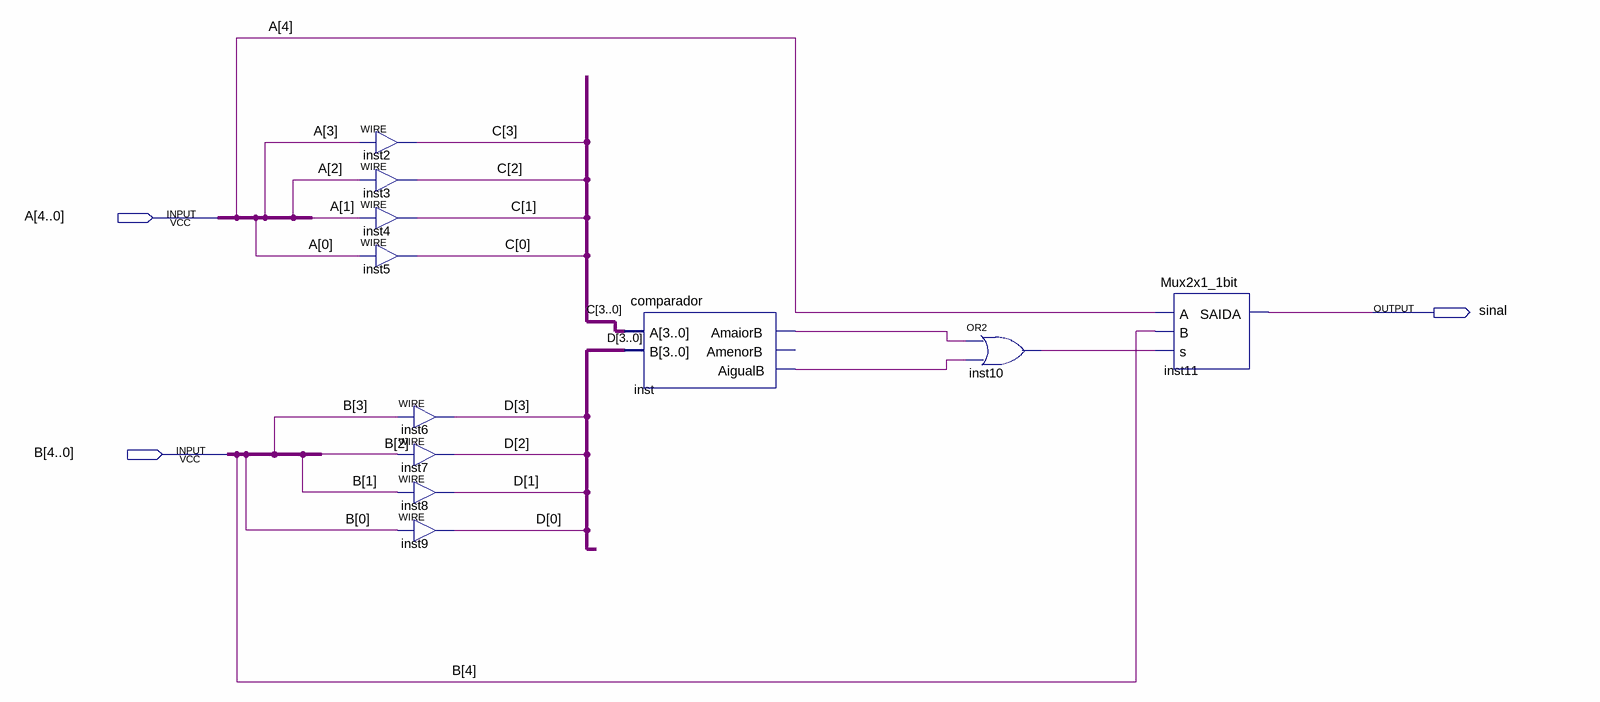
[diagram p0: schematic sheet]
// Quartus schematic sinal.bdf as structural Verilog: 11 symbols, 3 pins
module sinal (
  input  [4:0] A,
  input  [4:0] B,
  output sinal
);

  wire inst10_out, inst_aigualb, inst_amaiorb;
  wire [3:0] C, D;

  assign C[3] = A[3];  // WIRE inst2
  assign C[2] = A[2];  // WIRE inst3
  assign C[1] = A[1];  // WIRE inst4
  assign C[0] = A[0];  // WIRE inst5
  assign D[3] = B[3];  // WIRE inst6
  assign D[2] = B[2];  // WIRE inst7
  assign D[1] = B[1];  // WIRE inst8
  assign D[0] = B[0];  // WIRE inst9
  comparador inst (.A(C), .B(D), .AmaiorB(inst_amaiorb), .AigualB(inst_aigualb));  // open: AmenorB
  or inst10 (inst10_out, inst_amaiorb, inst_aigualb);
  Mux2x1_1bit inst11 (.A(A[4]), .B(B[4]), .s(inst10_out), .SAIDA(sinal));
endmodule
